# Altium schematic sheet 语音识别.SchDoc
size A4
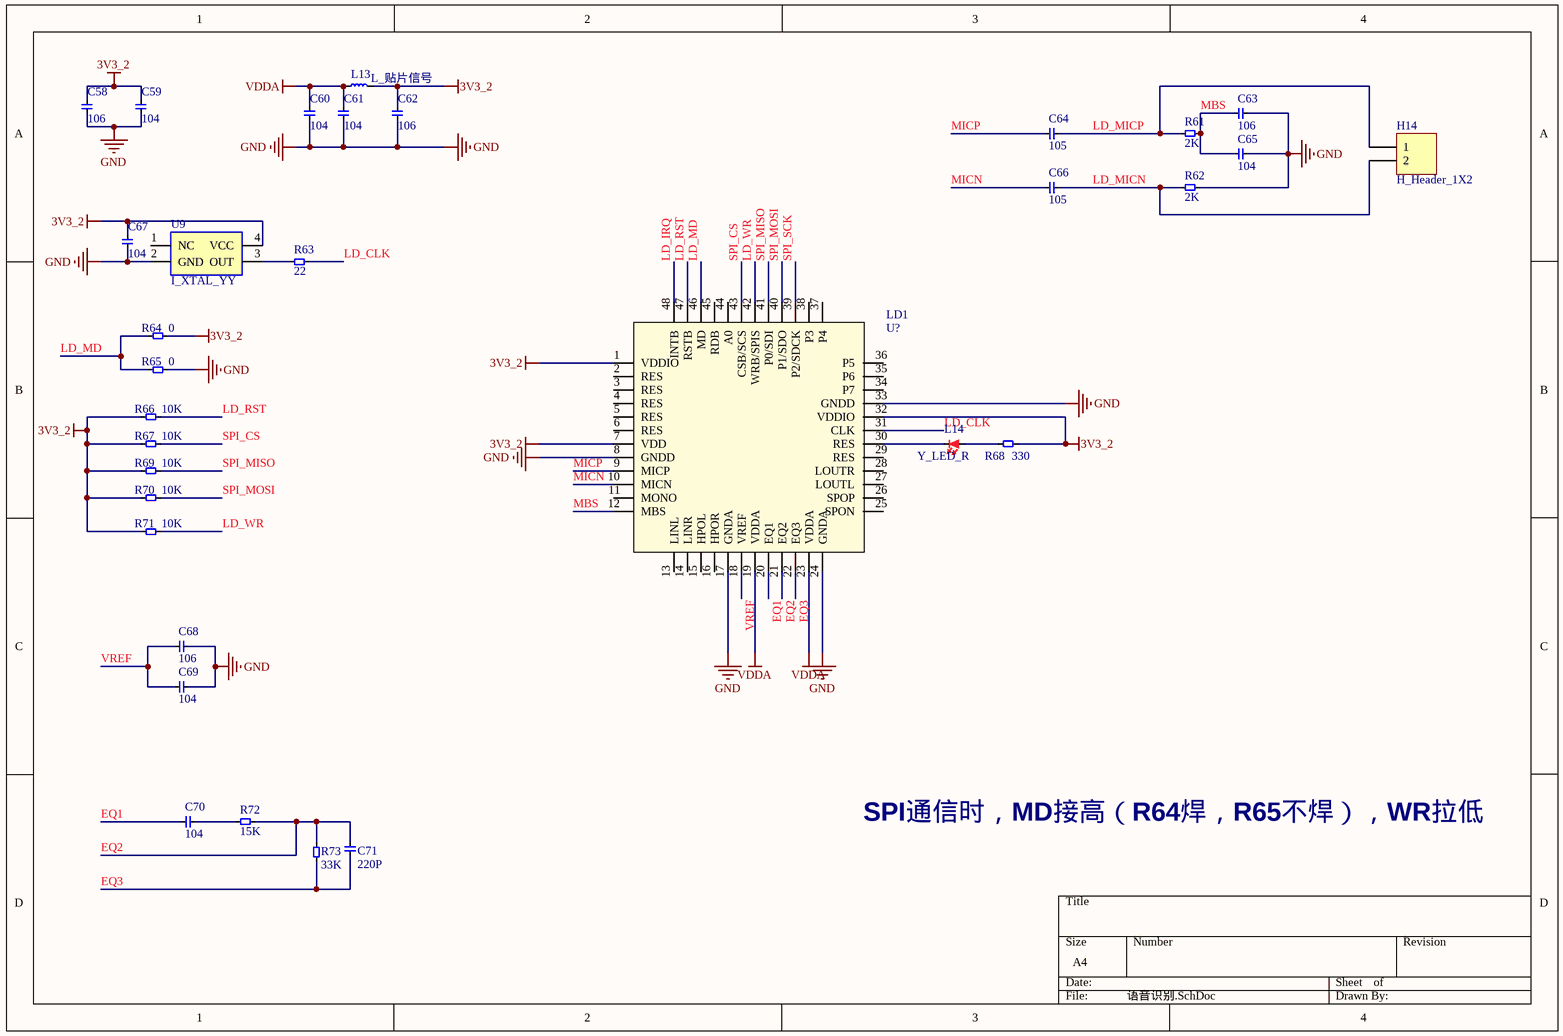
[diagram p0: 语音识别.SchDoc]

## Parts
C58  106  [C_0603]
C59  104  [C_0603]
C60  104  [C_0603]
C61  104  [C_0603]
C62  106  [C_0603]
C63  106  [C_0603]
C64  105  [C_0603]
C65  104  [C_0603]
C66  105  [C_0603]
C67  104  [C_0603]
C68  106  [C_0603]
C69  104  [C_0603]
C70  104  [C_0603]
C71  220P  [C_0603]
H14  H_Header_1X2  [H_Header_1X2]
L13  L_贴片信号  [L_0805]
L14  Y_LED_R  [Y_LED_0805_R]
LD1  U?  [QFN48]
R61  2K  [R_0603]
R62  2K  [R_0603]
R63  22  [R_0603]
R64  0  [R_0603]
R65  0  [R_0603]
R66  10K  [R_0603]
R67  10K  [R_0603]
R68  330  [R_0603]
R69  10K  [R_0603]
R70  10K  [R_0603]
R71  10K  [R_0603]
R72  15K  [R_0603]
R73  33K  [R_0603]
U9  I_XTAL_YY  [I_XTAL_YYSMD_3.2X2.5]

## Nets
3V3_2: C58.2 C59.2 C62.2 C67.2 L13.2 LD1.1(VDDIO) LD1.7(VDD) LD1.32(VDDIO) R64.2 R66.1 R67.1 R68.2 R69.1 R70.1 R71.1 U9.4(VCC)
GND: C58.1 C59.1 C60.1 C61.1 C62.1 C63.2 C65.2 C67.1 C68.1 C69.1 LD1.8(GNDD) LD1.17(GNDA) LD1.24(GNDA) LD1.33(GNDD) R62.2 R65.2 U9.2(GND)
VDDA: C60.2 C61.2 L13.1 LD1.19(VDDA) LD1.23(VDDA)
EQ1: C70.2 LD1.20(EQ1)
EQ2: C71.1 LD1.21(EQ2) R72.2 R73.2
EQ3: C71.2 LD1.22(EQ3) R73.1
LD_CLK: LD1.31(CLK) R63.2
LD_IRQ: LD1.48(INTB)
LD_MD: LD1.46(MD) R64.1 R65.1
LD_MICN: C66.2 H14.2 R62.1
LD_MICP: C64.2 H14.1 R61.1
LD_RST: LD1.47(RSTB) R66.2
LD_WR: LD1.42(WRB/SPIS) R71.2
MBS: C63.1 C65.1 LD1.12(MBS) R61.2
MICN: C66.1 LD1.10(MICN)
MICP: C64.1 LD1.9(MICP)
SPI_CS: LD1.43(CSB/SCS) R67.2
SPI_MISO: LD1.41(P0/SDI) R69.2
SPI_MOSI: LD1.40(P1/SDO) R70.2
SPI_SCK: LD1.39(P2/SDCK)
VREF: C68.2 C69.2 LD1.18(VREF)
NetC70_1: C70.1 R72.1
NetL14_1: L14.1 R68.1
NetL14_2: L14.2 LD1.30(RES)
NetR63_1: R63.1 U9.3(OUT)

Not connected (* = marked no-connect by the designer): LD1 2(RES) 3(RES) 4(RES) 5(RES) 6(RES) 11(MONO) 13(LINL) 14(LINR) 15(HPOL) 16(HPOR) 25(SPON) 26(SPOP) 27(LOUTL) 28(LOUTR) 29(RES) 34(P7) 35(P6) 36(P5) 37(P4) 38(P3) 44(A0) 45(RDB); U9 1(NC)

## Notes on the sheet
- SPI通信时，MD接高（R64焊，R65不焊），WR拉低

## Library data of the parts
C58-C71 = C_无极贴片: 无极性贴片电容
H14 = H_Header_1X2: 单排2针排针; LatestRevisionDate: 17-Jul-2002; LatestRevisionNote: Re-released for DXP Platform.; Publisher: Altium Limited
L13 = L_贴片信号: 贴片信号电感
L14 = Y_LED_R: 红色LED
LD1 = LD3320
R61-R73 = R_贴片: 贴片电阻
U9 = I_XTAL_YY: 有源晶振